# EAGLE schematic Voltage2CurrentSupply (EAGLE 7.4.0)
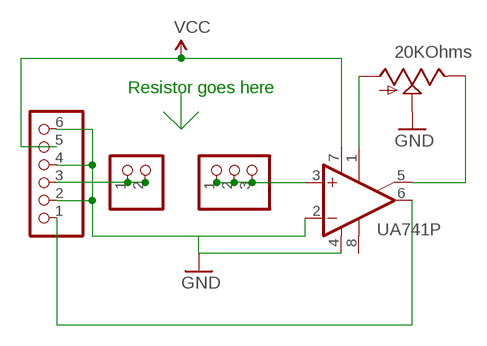
[diagram p0: schematic, sheet 1]

## Parts
IC1  UA741P  [DIL08]
JP1  PINHD-1X2  [1X02]
JP2  PINHD-1X3  [1X03]
JP3  PINHD-1X6  [1X06]
RV1  20KOhms  POT-RV16AF-20  [POT_ALPHA_RV16AF-20]

## Nets
GND: IC1.2(-IN) IC1.4(V-) JP3.2 JP3.4 JP3.6 RV1.2(S)
N$1: IC1.5(ON2) RV1.3(E)
N$2: IC1.3(+IN) JP2.1 JP2.2 JP2.3
N$3: JP1.1 JP1.2 JP3.3
N$5: IC1.6(OUT) JP3.1
N$7: IC1.1(ON1) RV1.1(A)
VCC: IC1.7(V+) JP3.5
Unconnected: IC1.8(OPT)

## Notes on the sheet
- Resistor goes here

## Library data of the parts
IC1 = linear:*741: OP AMP
JP1 = pinhead:PINHD-1X2: PIN HEADER
JP2 = pinhead:PINHD-1X3: PIN HEADER
JP3 = pinhead:PINHD-1X6: PIN HEADER
RV1 = SparkFun-Electromechanical:POT